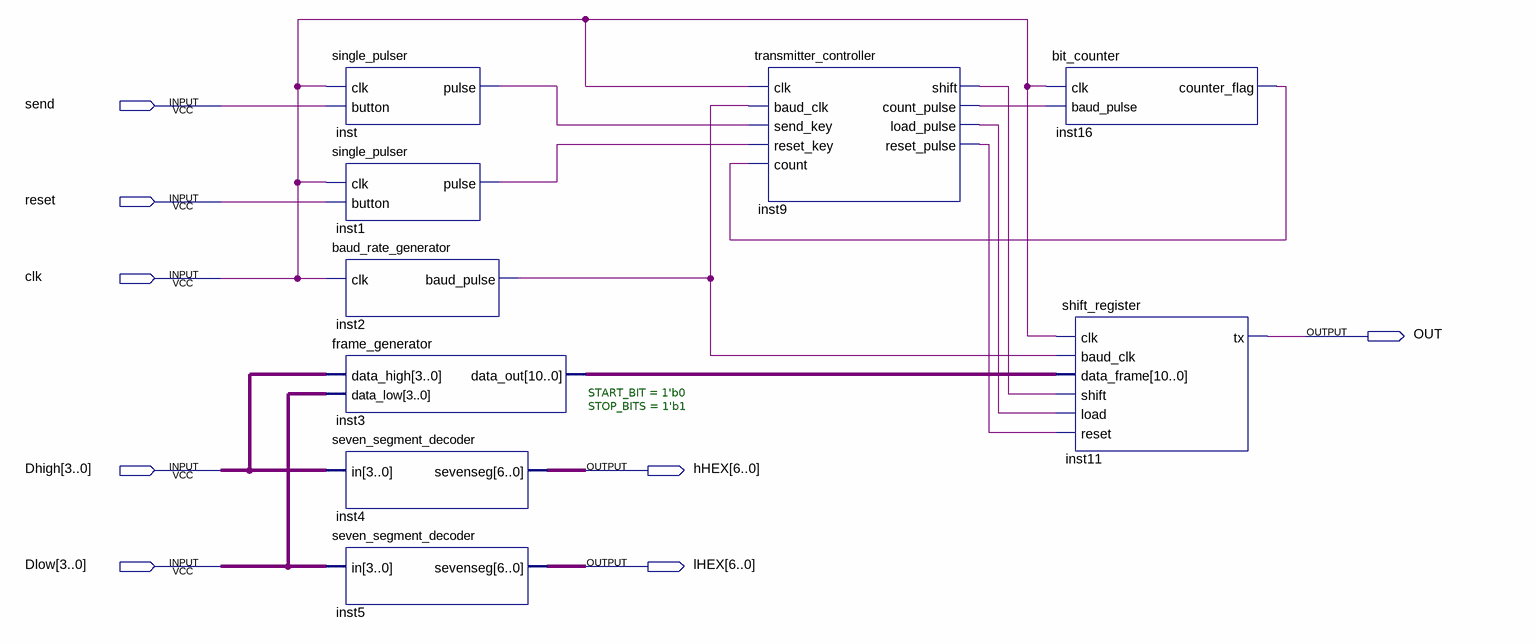
[diagram p0: schematic sheet]
// Quartus schematic uart_tx.bdf as structural Verilog: 9 symbols, 8 pins
module uart_tx (
  input  send,
  input  reset,
  input  clk,
  input  [3:0] Dhigh,
  input  [3:0] Dlow,
  output OUT,
  output [6:0] hHEX,
  output [6:0] lHEX
);

  wire inst1_pulse, inst2_baud_pulse, inst9_count_pulse, inst9_load_pulse, inst9_reset_pulse, inst9_shift,
       inst16_counter_flag, inst_pulse;
  wire [10:0] inst3_data_out;

  single_pulser inst (.clk(clk), .button(send), .pulse(inst_pulse));
  single_pulser inst1 (.clk(clk), .button(reset), .pulse(inst1_pulse));
  baud_rate_generator inst2 (.clk(clk), .baud_pulse(inst2_baud_pulse));
  frame_generator #(.START_BIT(1'b0), .STOP_BITS(1'b1)) inst3 (
    .data_high(Dhigh), .data_low(Dlow), .data_out(inst3_data_out));
  seven_segment_decoder inst4 (.in(Dhigh), .sevenseg(hHEX));
  seven_segment_decoder inst5 (.in(Dlow), .sevenseg(lHEX));
  transmitter_controller inst9 (
    .clk(clk), .baud_clk(inst2_baud_pulse), .send_key(inst_pulse), .reset_key(inst1_pulse),
    .count(inst16_counter_flag), .shift(inst9_shift), .count_pulse(inst9_count_pulse),
    .load_pulse(inst9_load_pulse), .reset_pulse(inst9_reset_pulse));
  bit_counter inst16 (.clk(clk), .baud_pulse(inst9_count_pulse), .counter_flag(inst16_counter_flag));
  shift_register inst11 (
    .clk(clk), .baud_clk(inst2_baud_pulse), .data_frame(inst3_data_out), .shift(inst9_shift),
    .load(inst9_load_pulse), .reset(inst9_reset_pulse), .tx(OUT));
endmodule
